# Altium schematic sheet LAB-01.SchDoc
size A
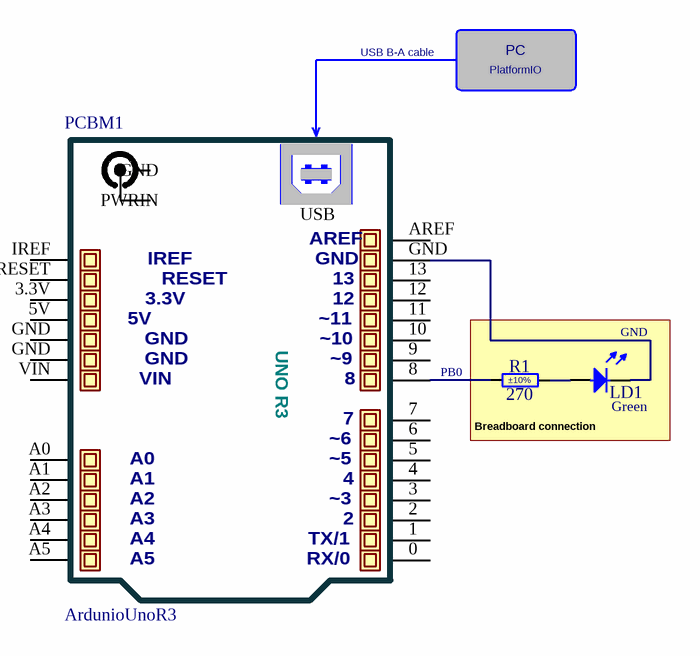
[diagram p0: LAB-01.SchDoc]

## Parts
LD1  Green  [LED_DIALIGHT_561-2201-050F]
PCBM1  ArdunioUnoR3
R1  270  Tolerance: ±10%  [RESC3216X65N]

## Blocks framed on the sheet
GND: LD1 R1

## Nets
NetLD1_1: LD1.1(C) PCBM1.GND
NetLD1_2: LD1.2(A) R1.2
NetPCBM1_8: PCBM1.8 R1.1

Not connected (* = marked no-connect by the designer): PCBM1 0 1 2 3 3.3V 4 5 5V 6 7 9 10 11 12 13 A0 A1 A2 A3 A4 A5 AREF IREF RESET VIN

## Notes on the sheet
- USB B-A cable
- PC
- PlatformIO
- PB0
- Breadboard connection
- (in symbol ArdunioUnoR3) PWRIN; USB; ~11; UNO R3; ~10; ~9; ~6; ~5; ~3; TX/1; RX/0

## Library data of the parts
LD1 = LED_DIALIGHT_561-2201-050F: LED Green 1C 2A; Part Description: Single Vertical 5mm HE Green LED With Housing Stand-off (D 7.1mmx H 6.985mm), Overall Height 12.7mm; PressFit: No; Bonding: No; Part Number: LED_DIALIGHT_561-2201-050F; Component Kind: Standard; Component Type: Standard; Color: Green; PackageDescription: Single Vertical 5mm HE Green LED With Housing Stand-off (D 7.1mmx H 6.985mm), Overall Height 12.7mm; Manufacturer: DIALIGHT; Manufacturer Part Number: 561-2201-050F; Pin Count: 2; Mounted: Yes; Socket: No; SMD: No; Sense: No; ComponentHeight: 12.7mm; HelpURL: \\cern.ch\dfs\Applications\Altium\Datasheets\LED_DIALIGHT_561-2201-050F.pdf; Author: CERN DEM JLC; CreateDate: 6. 6. 2018; LatestRevisionDate: 6. 6. 2018
PCBM1 = ArdunioUnoR3: ArdunioUnoR3 Universal SCH Symbol / (C) 230232
R1 = R1206_270R_0.1%_0.25W_25PPM: Resistor - 0.1%; Part Description: Thin Film Chip Resistor; Manufacturer: GENERIC; Manufacturer1 Part Number: RN73H2BTTD2700B25; Power: 0.25W; TC: ±25ppm/°C; PressFit: No; Part Number: R1206_270R_0.1%_0.25W_25PPM; Component Kind: Standard; Component Type: Standard; Pin Count: 2; Value: 270; Status: Not Recommended; Manufacturer Part Number: R1206_270R_0.1%_0.25W_25PPM; Case: 1206; Mounted: Yes; Sense: No; Socket: No; SMD: Yes; Manufacturer1 Example: KOA; Manufacturer1 ComponentHeight: 0.70mm; HelpURL: \\cern.ch\dfs\Applications\Altium\Datasheets\R1206_KOA_RN73H.pdf; Author: CERN DEM JLC; CreateDate: 3. 12. 2007; LatestRevisionDate: 13. 3. 2008